# Altium schematic sheet SoC_pwr_2.SchDoc
size A1
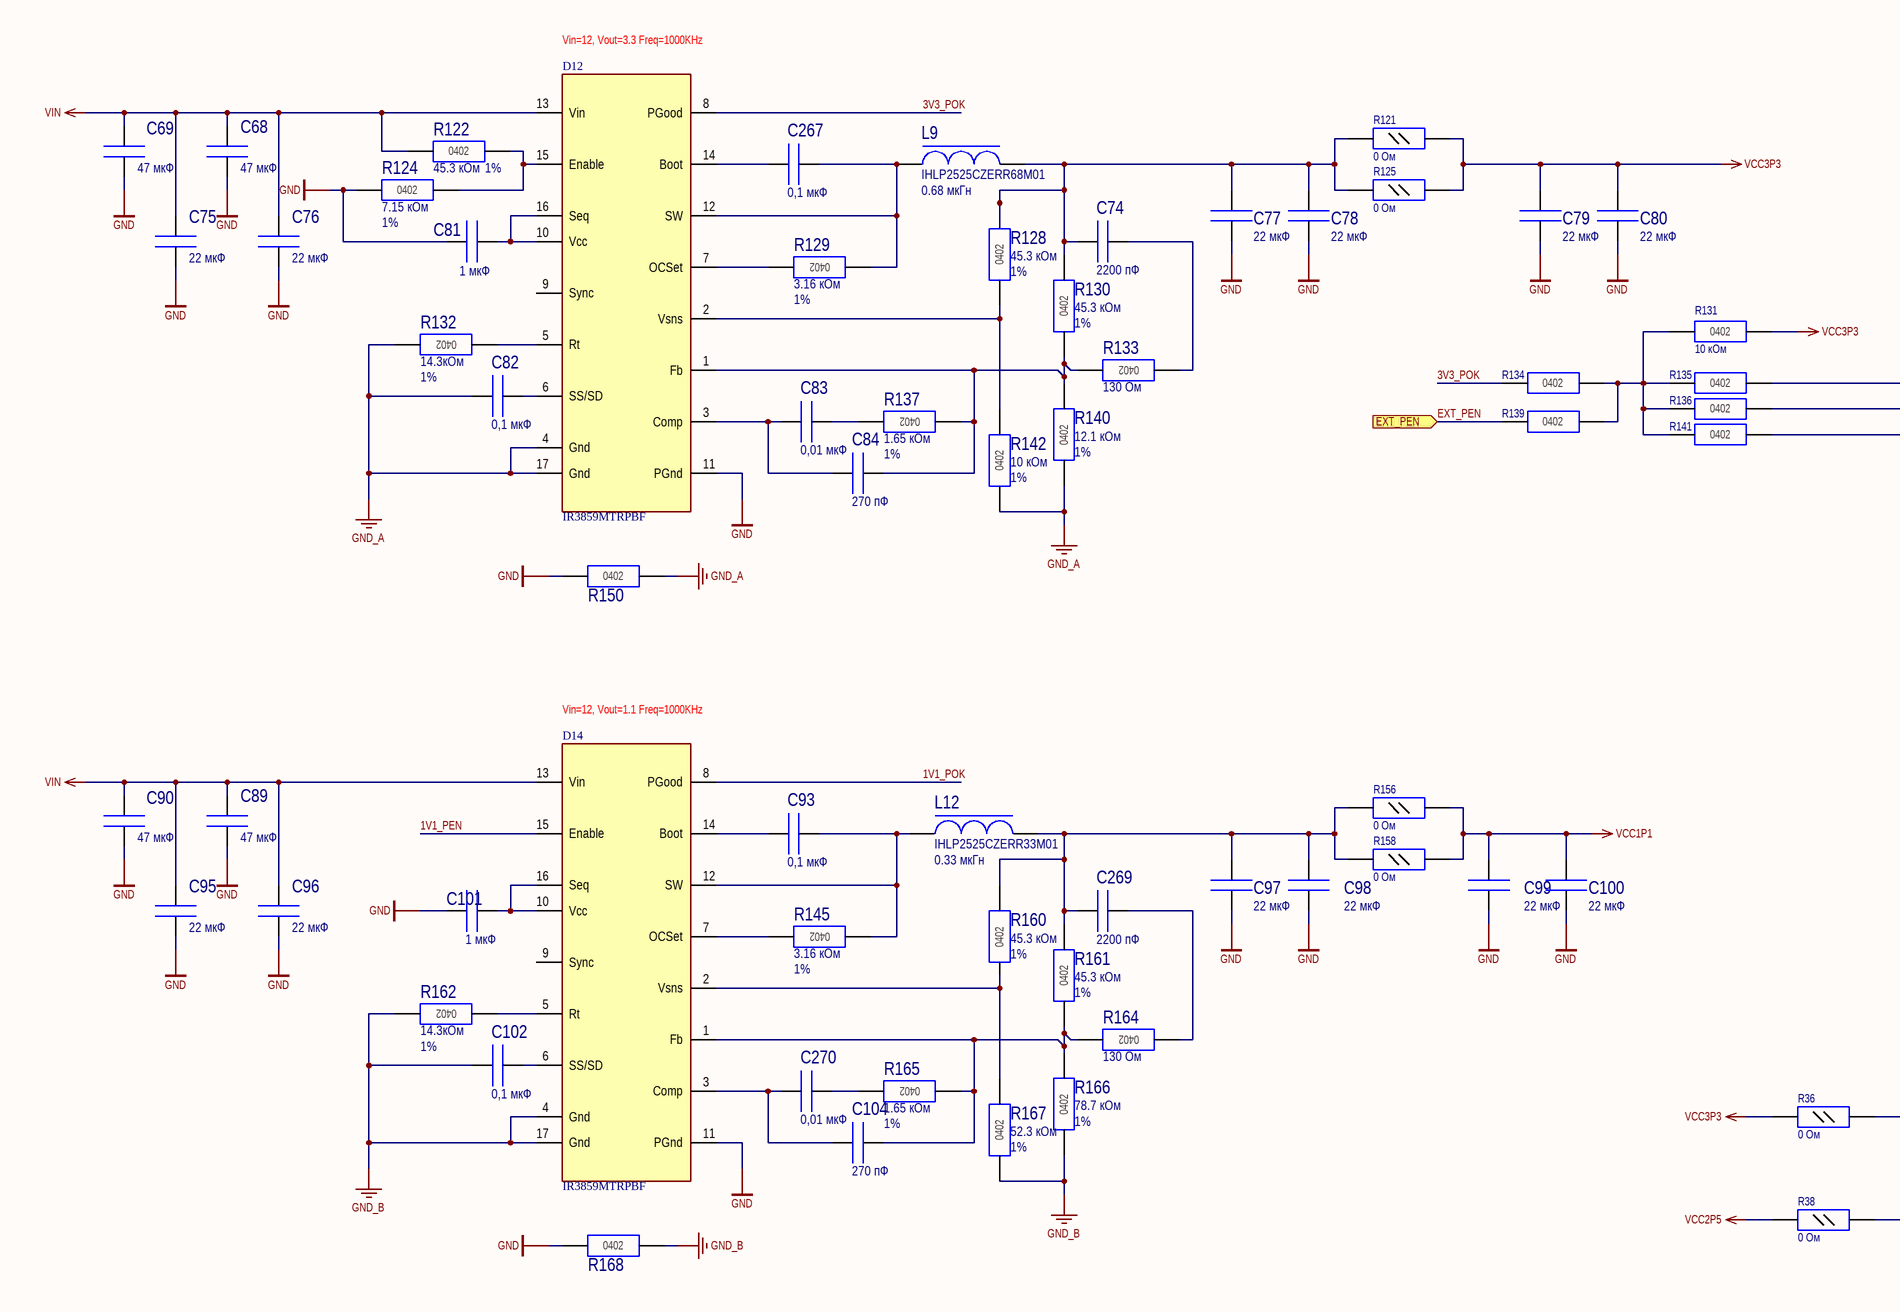
[diagram p0: SoC_pwr_2.SchDoc, left]
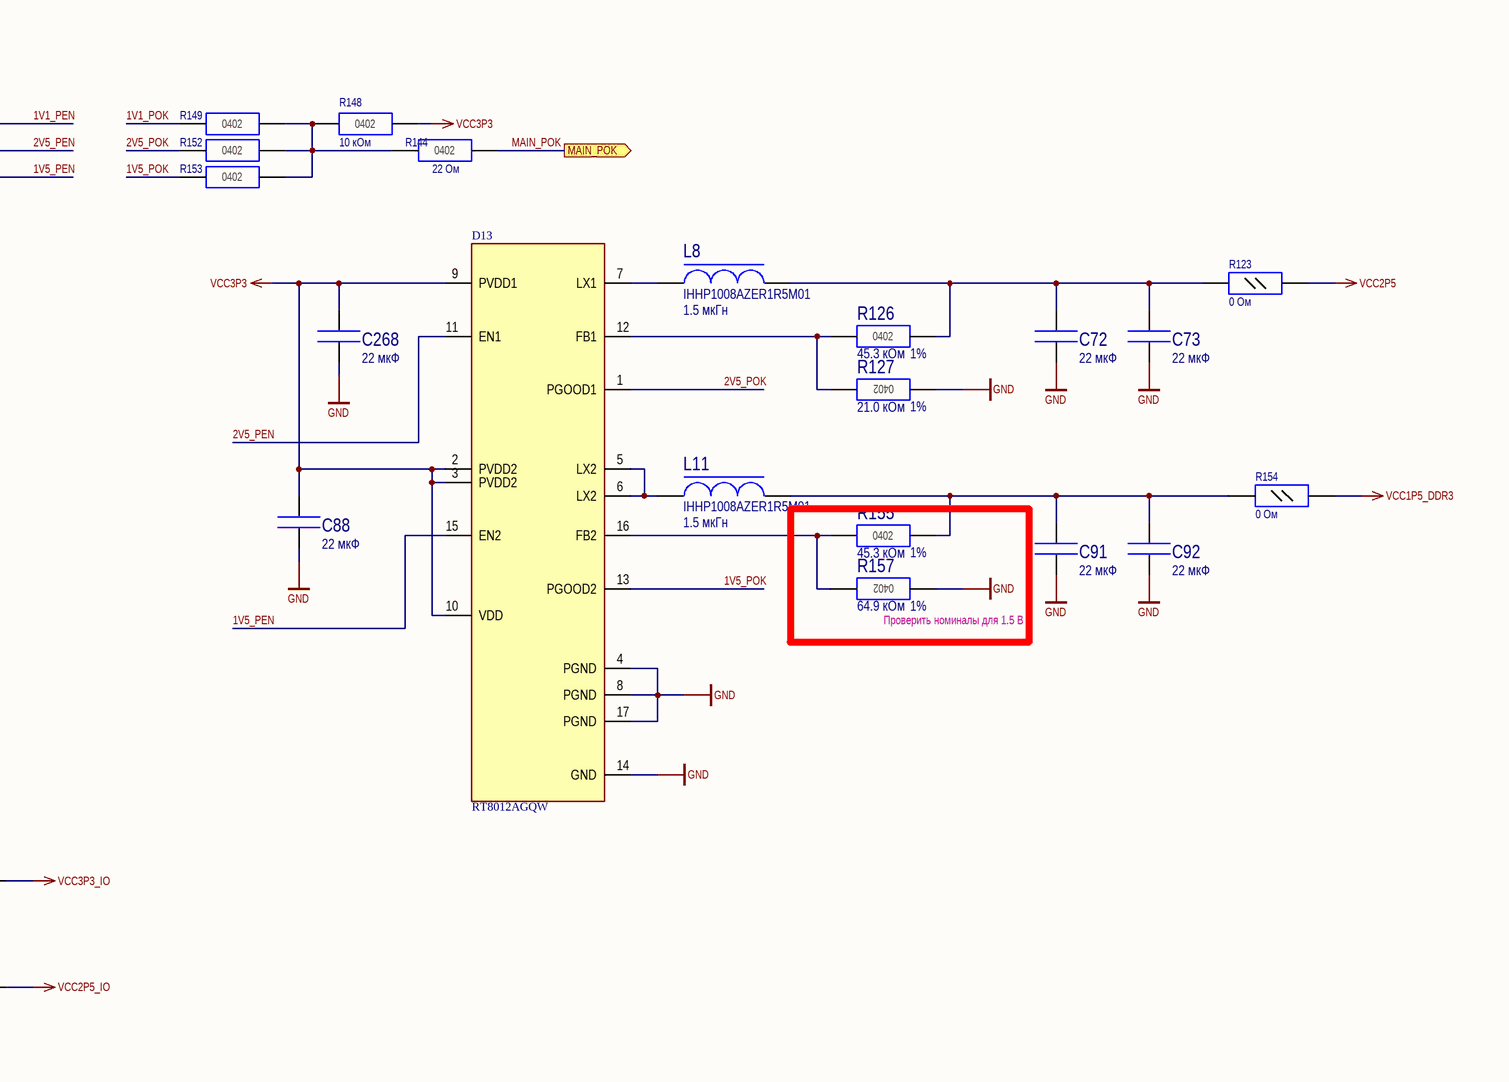
[diagram p1: SoC_pwr_2.SchDoc, right]

## Parts
C68  value 47 мкФ  [CC0603]  (hidden comment: CC0603-X5R-47 мкФ-20%-6,3В)
C69  value 47 мкФ  [CC0603]  (hidden comment: CC0603-X5R-47 мкФ-20%-6,3В)
C72  value 22 мкФ  [CC0603]  (hidden comment: CC0603-X5R-22 мкФ-20%-6,3В)
C73  value 22 мкФ  [CC0603]  (hidden comment: CC0603-X5R-22 мкФ-20%-6,3В)
C74  value 2200 пФ  [CC0402(1005)]  (hidden comment: CC0402-X7R-2200 пФ-10%-16В)
C75  value 22 мкФ  [CC0603]  (hidden comment: CC0603-X5R-22 мкФ-20%-6,3В)
C76  value 22 мкФ  [CC0603]  (hidden comment: CC0603-X5R-22 мкФ-20%-6,3В)
C77  value 22 мкФ  [CC0603]  (hidden comment: CC0603-X5R-22 мкФ-20%-6,3В)
C78  value 22 мкФ  [CC0603]  (hidden comment: CC0603-X5R-22 мкФ-20%-6,3В)
C79  value 22 мкФ  [CC0603]  (hidden comment: CC0603-X5R-22 мкФ-20%-6,3В)
C80  value 22 мкФ  [CC0603]  (hidden comment: CC0603-X5R-22 мкФ-20%-6,3В)
C81  value 1 мкФ  [CC0603]  (hidden comment: CC0603-X5R-1 мкФ-10%-25В)
C82  value 0,1 мкФ  [CC0402(1005)]  (hidden comment: CC0402-X7R-0,1 мкФ-20%-10В)
C83  value 0,01 мкФ  [CC0402(1005)]  (hidden comment: CC0402-X7R-0,01 мкФ-10%-50В)
C84  value 270 пФ  [CC0402(1005)]  (hidden comment: CC0402-NP0-270 пФ-1%-50В)
C88  value 22 мкФ  [CC0603]  (hidden comment: CC0603-X5R-22 мкФ-20%-6,3В)
C89  value 47 мкФ  [CC0603]  (hidden comment: CC0603-X5R-47 мкФ-20%-6,3В)
C90  value 47 мкФ  [CC0603]  (hidden comment: CC0603-X5R-47 мкФ-20%-6,3В)
C91  value 22 мкФ  [CC0603]  (hidden comment: CC0603-X5R-22 мкФ-20%-6,3В)
C92  value 22 мкФ  [CC0603]  (hidden comment: CC0603-X5R-22 мкФ-20%-6,3В)
C93  value 0,1 мкФ  [CC0402(1005)]  (hidden comment: CC0402-X7R-0,1 мкФ-20%-10В)
C95  value 22 мкФ  [CC0603]  (hidden comment: CC0603-X5R-22 мкФ-20%-6,3В)
C96  value 22 мкФ  [CC0603]  (hidden comment: CC0603-X5R-22 мкФ-20%-6,3В)
C97  value 22 мкФ  [CC0603]  (hidden comment: CC0603-X5R-22 мкФ-20%-6,3В)
C98  value 22 мкФ  [CC0603]  (hidden comment: CC0603-X5R-22 мкФ-20%-6,3В)
C99  value 22 мкФ  [CC0603]  (hidden comment: CC0603-X5R-22 мкФ-20%-6,3В)
C100  value 22 мкФ  [CC0603]  (hidden comment: CC0603-X5R-22 мкФ-20%-6,3В)
C101  value 1 мкФ  [CC0603]  (hidden comment: CC0603-X5R-1 мкФ-10%-25В)
C102  value 0,1 мкФ  [CC0402(1005)]  (hidden comment: CC0402-X7R-0,1 мкФ-20%-10В)
C104  value 270 пФ  [CC0402(1005)]  (hidden comment: CC0402-NP0-270 пФ-1%-50В)
C267  value 0,1 мкФ  [CC0402(1005)]  (hidden comment: CC0402-X7R-0,1 мкФ-20%-10В)
C268  value 22 мкФ  [CC0603]  (hidden comment: CC0603-X5R-22 мкФ-20%-6,3В)
C269  value 2200 пФ  [CC0402(1005)]  (hidden comment: CC0402-X7R-2200 пФ-10%-16В)
C270  value 0,01 мкФ  [CC0402(1005)]  (hidden comment: CC0402-X7R-0,01 мкФ-10%-50В)
D12  IR3859MTRPBF  [IR3859]
D13  RT8012AGQW  [RT8012AGQW]
D14  IR3859MTRPBF  [IR3859]
L8  IHHP1008AZER1R5M01  value 1.5 мкГн  [INDC2720X12L]
L9  IHLP2525CZERR68M01  value 0.68 мкГн  [INDP6965X30L]
L11  IHHP1008AZER1R5M01  value 1.5 мкГн  [INDC2720X12L]
L12  IHLP2525CZERR33M01  value 0.33 мкГн  [INDP6965X30L]
R36  value 0 Ом  [CR0805]  (hidden comment: CR0805-0 Ом-±5%)
R38  value 0 Ом  [CR0805]  (hidden comment: CR0805-0 Ом-±5%)
R121  value 0 Ом  [CR0805]  (hidden comment: CR0805-0 Ом-±5%)
R122  value 45.3 кОм  TOLERANCE: 1%  [CR0402(1005)]  (hidden comment: CR0402-45.3 кОм-±1%)
R123  value 0 Ом  [CR0805]  (hidden comment: CR0805-0 Ом-±5%)
R124  value 7.15 кОм  TOLERANCE: 1%  [CR0402(1005)]  (hidden comment: CR0402-7.15 кОм-±1%)
R125  value 0 Ом  [CR0805]  (hidden comment: CR0805-0 Ом-±5%)
R126  value 45.3 кОм  TOLERANCE: 1%  [CR0402(1005)]  (hidden comment: CR0402-45.3 кОм-±1%)
R127  value 21.0 кОм  TOLERANCE: 1%  [CR0402(1005)]  (hidden comment: CR0402-21.0 кОм-±1%)
R128  value 45.3 кОм  TOLERANCE: 1%  [CR0402(1005)]  (hidden comment: CR0402-45.3 кОм-±1%)
R129  value 3.16 кОм  TOLERANCE: 1%  [CR0402(1005)]  (hidden comment: CR0402-3.16 кОм-±1%)
R130  value 45.3 кОм  TOLERANCE: 1%  [CR0402(1005)]  (hidden comment: CR0402-45.3 кОм-±1%)
R131  value 10 кОм  [CR0402(1005)]  (hidden comment: CR0402-10 кОм-±5%)
R132  value 14.3кОм  TOLERANCE: 1%  [CR0402(1005)]  (hidden comment: CR0402-14.3кОм-±1%)
R133  value 130 Ом  [CR0402(1005)]  (hidden comment: CR0402-130 Ом-±1%)
R134  CR0402-0 Ом-±5%  [CR0402(1005)]  (value not drawn)
R135  CR0402-0 Ом-±5%  [CR0402(1005)]  (value not drawn)
R136  CR0402-0 Ом-±5%  [CR0402(1005)]  (value not drawn)
R137  value 1.65 кОм  TOLERANCE: 1%  [CR0402(1005)]  (hidden comment: CR0402-1.65 кОм-±1%)
R139  CR0402-0 Ом-±5%  [CR0402(1005)]  (value not drawn)
R140  value 12.1 кОм  TOLERANCE: 1%  [CR0402(1005)]  (hidden comment: CR0402-12.1 кОм-±1%)
R141  CR0402-0 Ом-±5%  [CR0402(1005)]  (value not drawn)
R142  value 10 кОм  TOLERANCE: 1%  [CR0402(1005)]  (hidden comment: CR0402-10 кОм-±1%)
R144  value 22 Ом  [CR0402(1005)]  (hidden comment: CR0402-22 Ом-±5%)
R145  value 3.16 кОм  TOLERANCE: 1%  [CR0402(1005)]  (hidden comment: CR0402-3.16 кОм-±1%)
R148  value 10 кОм  [CR0402(1005)]  (hidden comment: CR0402-10 кОм-±5%)
R149  CR0402-0 Ом-±5%  [CR0402(1005)]  (value not drawn)
R150  CR0402-0 Ом-±5%  [CR0402(1005)]  (value not drawn)
R152  CR0402-0 Ом-±5%  [CR0402(1005)]  (value not drawn)
R153  CR0402-0 Ом-±5%  [CR0402(1005)]  (value not drawn)
R154  value 0 Ом  [CR0805]  (hidden comment: CR0805-0 Ом-±5%)
R155  value 45.3 кОм  TOLERANCE: 1%  [CR0402(1005)]  (hidden comment: CR0402-45.3 кОм-±1%)
R156  value 0 Ом  [CR0805]  (hidden comment: CR0805-0 Ом-±5%)
R157  value 64.9 кОм  TOLERANCE: 1%  [CR0402(1005)]  (hidden comment: CR0402-64.9 кОм-±1%)
R158  value 0 Ом  [CR0805]  (hidden comment: CR0805-0 Ом-±5%)
R160  value 45.3 кОм  TOLERANCE: 1%  [CR0402(1005)]  (hidden comment: CR0402-45.3 кОм-±1%)
R161  value 45.3 кОм  TOLERANCE: 1%  [CR0402(1005)]  (hidden comment: CR0402-45.3 кОм-±1%)
R162  value 14.3кОм  TOLERANCE: 1%  [CR0402(1005)]  (hidden comment: CR0402-14.3кОм-±1%)
R164  value 130 Ом  [CR0402(1005)]  (hidden comment: CR0402-130 Ом-±1%)
R165  value 1.65 кОм  TOLERANCE: 1%  [CR0402(1005)]  (hidden comment: CR0402-1.65 кОм-±1%)
R166  value 78.7 кОм  TOLERANCE: 1%  [CR0402(1005)]  (hidden comment: CR0402-78.7 кОм-±1%)
R167  value 52.3 кОм  TOLERANCE: 1%  [CR0402(1005)]  (hidden comment: CR0402-52.3 кОм-±1%)
R168  CR0402-0 Ом-±5%  [CR0402(1005)]  (value not drawn)

## Blocks framed on the sheet
Проверить номиналы для 1.5 В: R155 R157

## Ports
EXT_PEN (in), MAIN_POK (out)

## Nets
GND: C68.2(-) C69.2(-) C72.2(-) C73.2(-) C75.2(-) C76.2(-) C77.2(-) C78.2(-) C79.2(-) C80.2(-) C81.1(+) C88.2(-) C89.2(-) C90.2(-) C91.2(-) C92.2(-) C95.2(-) C96.2(-) C97.2(-) C98.2(-) C99.2(-) C100.2(-) C101.1(+) C268.2(-) D12.11(PGnd) D13.4(PGND) D13.8(PGND) D13.14(GND) D13.17(PGND) D14.11(PGnd) R124.1(+) R127.1(+) R150.1(+) R157.1(+) R168.1(+)
GND_A: C82.1(+) D12.4(Gnd) D12.17(Gnd) R132.2(-) R140.1(+) R142.1(+) R150.2(-)
GND_B: C102.1(+) D14.4(Gnd) D14.17(Gnd) R162.2(-) R166.1(+) R167.1(+) R168.2(-)
VCC1P1: C99.1(+) C100.1(+) R156.2(-) R158.2(-)
VCC1P5_DDR3: R154.2(-)
VCC2P5: R38.1(+) R123.2(-)
VCC2P5_IO: R38.2(-)
VCC3P3: C79.1(+) C80.1(+) C88.1(+) C268.1(+) D13.2(PVDD2) D13.3(PVDD2) D13.9(PVDD1) D13.10(VDD) R36.1(+) R121.2(-) R125.2(-) R131.2(-) R148.2(-)
VCC3P3_IO: R36.2(-)
VIN: C68.1(+) C69.1(+) C75.1(+) C76.1(+) C89.1(+) C90.1(+) C95.1(+) C96.1(+) D12.13(Vin) D14.13(Vin) R122.1(+)
1V1_PEN: D14.15(Enable) R135.2(-)
1V1_POK: D14.8(PGood) R149.1(+)
1V5_PEN: D13.15(EN2) R141.2(-)
1V5_POK: D13.13(PGOOD2) R153.1(+)
2V5_PEN: D13.11(EN1) R136.2(-)
2V5_POK: D13.1(PGOOD1) R152.1(+)
3V3_POK: D12.8(PGood) R134.1(+)
EXT_PEN: R139.1(+) ; port EXT_PEN
MAIN_POK: R144.2(-) ; port MAIN_POK
NetC72_1: C72.1(+) C73.1(+) L8.2 R123.1(+) R126.2(-)
NetC74_1: C74.1(+) R133.1(+)
NetC74_2: C74.2(-) C77.1(+) C78.1(+) L9.2 R121.1(+) R125.1(+) R128.2(-) R130.2(-)
NetC81_2: C81.2(-) D12.10(Vcc) D12.16(Seq)
NetC82_2: C82.2(-) D12.6(SS/SD)
NetC83_1: C83.1(+) C84.2(-) D12.3(Comp)
NetC83_2: C83.2(-) R137.2(-)
NetC84_1: C84.1(+) D12.1(Fb) R130.1(+) R133.2(-) R137.1(+) R140.2(-)
NetC91_1: C91.1(+) C92.1(+) L11.2 R154.1(+) R155.2(-)
NetC93_1: C93.1(+) D14.14(Boot)
NetC93_2: C93.2(-) D14.12(SW) L12.1 R145.1(+)
NetC97_1: C97.1(+) C98.1(+) C269.2(-) L12.2 R156.1(+) R158.1(+) R160.2(-) R161.2(-)
NetC101_2: C101.2(-) D14.10(Vcc) D14.16(Seq)
NetC102_2: C102.2(-) D14.6(SS/SD)
NetC104_1: C104.1(+) D14.1(Fb) R161.1(+) R164.2(-) R165.1(+) R166.2(-)
NetC104_2: C104.2(-) C270.1(+) D14.3(Comp)
NetC267_1: C267.1(+) D12.14(Boot)
NetC267_2: C267.2(-) D12.12(SW) L9.1 R129.1(+)
NetC269_1: C269.1(+) R164.1(+)
NetC270_2: C270.2(-) R165.2(-)
NetD12_2: D12.2(Vsns) R128.1(+) R142.2(-)
NetD12_5: D12.5(Rt) R132.1(+)
NetD12_7: D12.7(OCSet) R129.2(-)
NetD12_15: D12.15(Enable) R122.2(-) R124.2(-)
NetD13_5: D13.5(LX2) D13.6(LX2) L11.1
NetD13_7: D13.7(LX1) L8.1
NetD13_12: D13.12(FB1) R126.1(+) R127.2(-)
NetD13_16: D13.16(FB2) R155.1(+) R157.2(-)
NetD14_2: D14.2(Vsns) R160.1(+) R167.2(-)
NetD14_5: D14.5(Rt) R162.1(+)
NetD14_7: D14.7(OCSet) R145.2(-)
NetR131_1: R131.1(+) R134.2(-) R135.1(+) R136.1(+) R139.2(-) R141.1(+)
NetR144_1: R144.1(+) R148.1(+) R149.2(-) R152.2(-) R153.2(-)

Not connected (* = marked no-connect by the designer): D12 9(Sync); D14 9(Sync)

## Notes on the sheet
- Vin=12, Vout=3.3 Freq=1000KHz
- Vin=12, Vout=1.1 Freq=1000KHz
- (in symbol CR0402-#-±1%) 0402
- (in symbol CR0402-#-±5%) 0402

## Library data of the parts
C68 C69 C89 C90 = CC0603-X5R-#-20%-6,3В: Чип конденсатор керамический; Vendor: Yageo; Vendor P/N: CC0603MKX5R4BB476; Supplier 1: Digi-key; Supplier Part Number 1: 311-3491-2-ND
C72 C73 C75-C80 C88 C91 C92 C95-C100 C268 = CC0603-X5R-#-20%-6,3В: Чип конденсатор керамический; Vendor: TDK; Vendor P/N: C1608X5R0J226M080AC; Supplier 1: Digi-key; Supplier Part Number 1: 445-8028-2-ND
C74 C82-C84 C93 C102 C104 C267 C269 C270 = CC0402-X7R-#-20%-10В: Чип конденсатор керамический; Supplier 1: Digi-Key
  C74 C269: Supplier Part Number 1: 490-3190-2-ND
  C82 C93 C102 C267: Supplier Part Number 1: 399-3520-1-ND
  C83 C270: Supplier Part Number 1: 490-4516-2-ND
  C84 C104: Supplier Part Number 1: 490-10686-2-ND
C81 C101 = CC0603-X5R-#-20%-6,3В: Чип конденсатор керамический; Компэл: CC0603KRX5R8BB105 (YAG); Supplier 1: Digi-Key; Supplier Part Number 1: 311-1445-2-ND
D12 D14 = IR3859MPbF: IC REG BUCK ADJ 9A SYNC 17PQFN; Supplier: Digi-key: IR3859MTRPBFCT-ND
L8 L11 = L_VISH_IIHHP1008ABE_1: FIXED IND 1.5UH 2.4A 96 MOHM SMD; Supplier 1: Digi-Key; Supplier Part Number 1: 541-2676-6-ND
L9 L12 = L_VISH_IHLP2525CZERR68M01: FIXED IND 680NH 15.5A 5.5 MOHM; Supplier 1: Digi-Key
  L9: Supplier Part Number 1: 541-1004-1-ND
  L12: Supplier Part Number 1: 541-1002-2-ND
R36 R38 R121 R123 R125 R154 R156 R158 = CR0805-#-±5%: Чип резистор; Supplier 1: Digi-Key; Supplier Part Number 1: 311-0.0JRDKR-ND
R122 R124 R126-R130 R132 R133 R137 R140 R142 R145 R155 R157 R160-R162 R164-R167 = CR0402-#-±1%: Чип резистор; Maximum Working Voltage: 50 В; Supplier 1: Digi-Key
  R122 R126 R128 R130 R155 R160 R161: Supplier Part Number 1: 311-45.3KLRTR-ND
  R124: Supplier Part Number 1: YAG3235TR-ND
  R127: Supplier Part Number 1: 311-21.0KLRTR-ND
  R129 R145: Supplier Part Number 1: RC0402FR-073K16L
  R132 R162: Supplier Part Number 1: 311-14.3KLRCT-ND
  R133 R164: Supplier Part Number 1: RC0402FR-07130RL
  R137 R165: Supplier Part Number 1: RC0402FR-071K65L
  R140: Supplier Part Number 1: 311-12.1KLRTR-ND
  R142: Supplier Part Number 1: RC0402FR-0710KL
  R157: Supplier Part Number 1: 311-649KLRTR-ND
  R166: Supplier Part Number 1: 311-78.7KLRTR-ND
  R167: Supplier Part Number 1: RC0402FR-0752K3L
R131 R144 R148 = CR0402-#-±5%: Чип резистор; Maximum Working Voltage: 50 В; TOLERANCE: 5%; Supplier 1: Digi-Key
  R131 R148: Supplier Part Number 1: 311-10.0KJRTR-ND
  R144: Supplier Part Number 1: 311-10.0KLRDKR-ND
R134-R136 R139 R141 R149 R150 R152 R153 R168 = CR0402-#-±5%: Чип резистор; Maximum Working Voltage: 50 В; TOLERANCE: 5%; VALUE: 0 Ом; Supplier 1: Digi-Key; Supplier Part Number 1: 311-10.0KLRDKR-ND